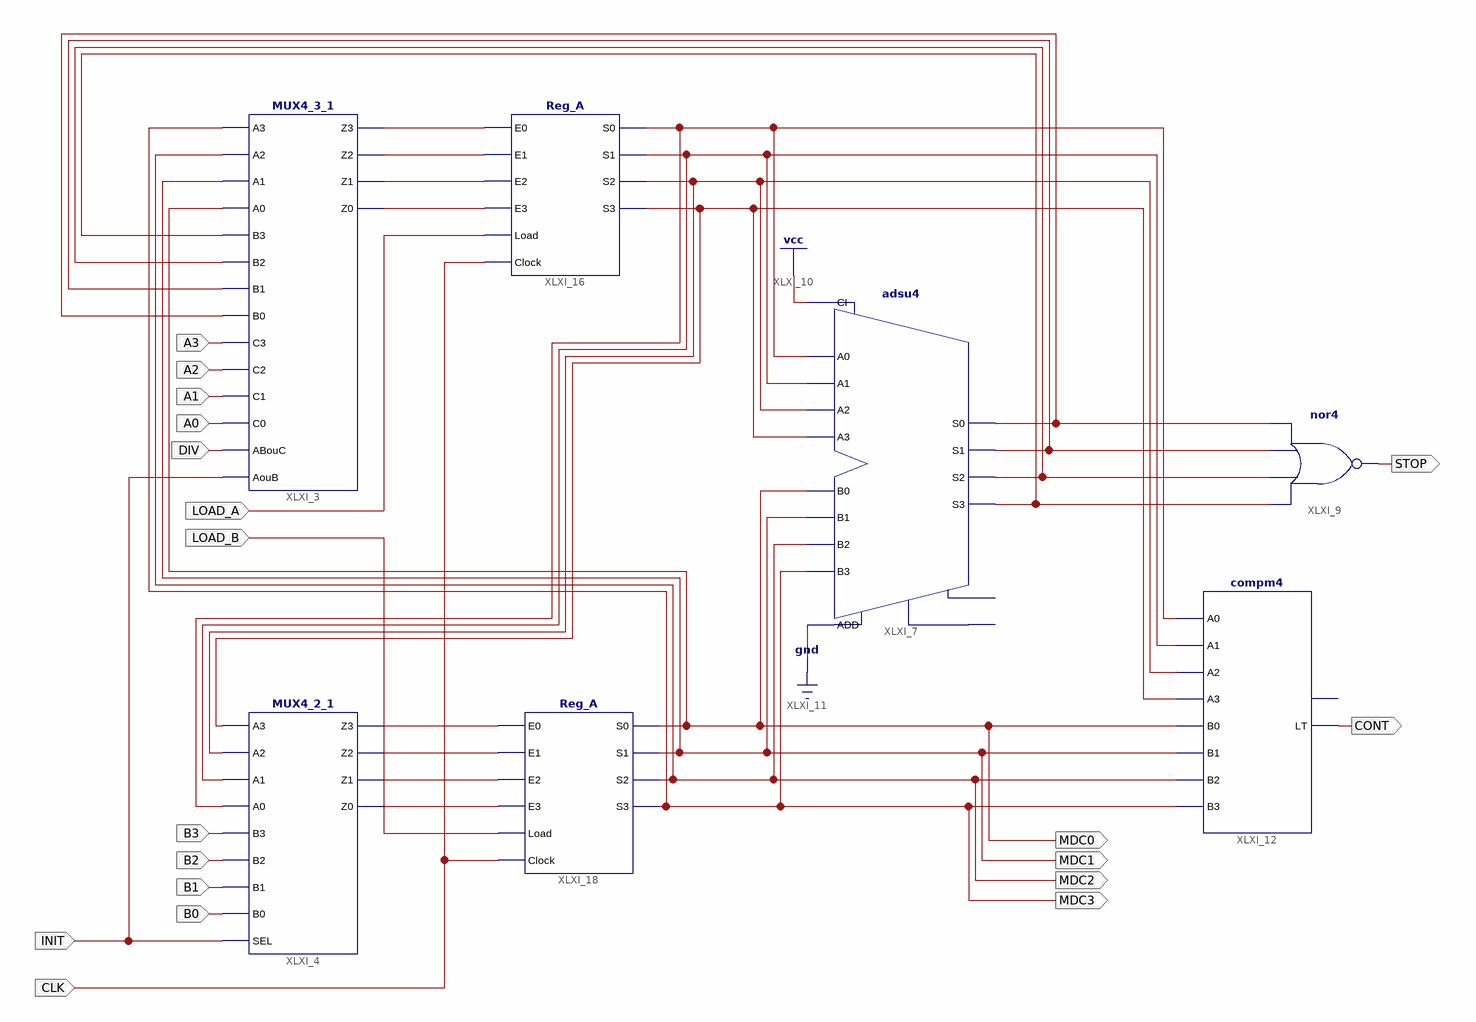
[diagram p0: schematic sheet 1]
// Xilinx ISE schematic Data.sch (spartan3e) as structural Verilog: 7 symbols, 19 ports
module Data (
  input  A0,
  input  A1,
  input  A2,
  input  A3,
  input  LOAD_A,
  input  B0,
  input  B1,
  input  B2,
  input  B3,
  input  INIT,
  input  LOAD_B,
  input  DIV,
  input  CLK,
  output MDC1,
  output MDC2,
  output MDC0,
  output MDC3,
  output STOP,
  output CONT
);

  wire XLXN_44, XLXN_54, XLXN_61, XLXN_63, XLXN_65, XLXN_66, XLXN_67, XLXN_68, XLXN_82, XLXN_84, XLXN_85,
       XLXN_86, XLXN_87, XLXN_98, XLXN_99, XLXN_100;

  MUX4_3_1 XLXI_3 (
    .A0(MDC0), .A1(MDC1), .A2(MDC2), .A3(MDC3), .ABouC(DIV), .AouB(INIT), .B0(XLXN_61), .B1(XLXN_44),
    .B2(XLXN_54), .B3(XLXN_63), .C0(A0), .C1(A1), .C2(A2), .C3(A3), .Z0(XLXN_68), .Z1(XLXN_67), .Z2(XLXN_66),
    .Z3(XLXN_65));
  MUX4_2_1 XLXI_4 (
    .A0(XLXN_82), .A1(XLXN_98), .A2(XLXN_99), .A3(XLXN_100), .B0(B0), .B1(B1), .B2(B2), .B3(B3), .SEL(INIT),
    .Z0(XLXN_87), .Z1(XLXN_86), .Z2(XLXN_85), .Z3(XLXN_84));
  adsu4 XLXI_7 (
    .A0(XLXN_82), .A1(XLXN_98), .A2(XLXN_99), .A3(XLXN_100), .ADD(1'b0), .B0(MDC0), .B1(MDC1), .B2(MDC2),
    .B3(MDC3), .CI(1'b1), .S0(XLXN_61), .S1(XLXN_44), .S2(XLXN_54), .S3(XLXN_63));  // open: CO, OFL
  nor XLXI_9 (STOP, XLXN_63, XLXN_54, XLXN_44, XLXN_61);
  compm4 XLXI_12 (
    .A0(XLXN_82), .A1(XLXN_98), .A2(XLXN_99), .A3(XLXN_100), .B0(MDC0), .B1(MDC1), .B2(MDC2), .B3(MDC3),
    .LT(CONT));  // open: GT
  Reg_A XLXI_16 (
    .Clock(CLK), .E0(XLXN_65), .E1(XLXN_66), .E2(XLXN_67), .E3(XLXN_68), .Load(LOAD_A), .S0(XLXN_82),
    .S1(XLXN_98), .S2(XLXN_99), .S3(XLXN_100));
  Reg_A XLXI_18 (
    .Clock(CLK), .E0(XLXN_84), .E1(XLXN_85), .E2(XLXN_86), .E3(XLXN_87), .Load(LOAD_B), .S0(MDC0), .S1(MDC1),
    .S2(MDC2), .S3(MDC3));
endmodule
